# Altium schematic sheet ANALOG.SchDoc
size A3; DocumentNumber: 1; SheetNumber: 1; SheetTotal: 2
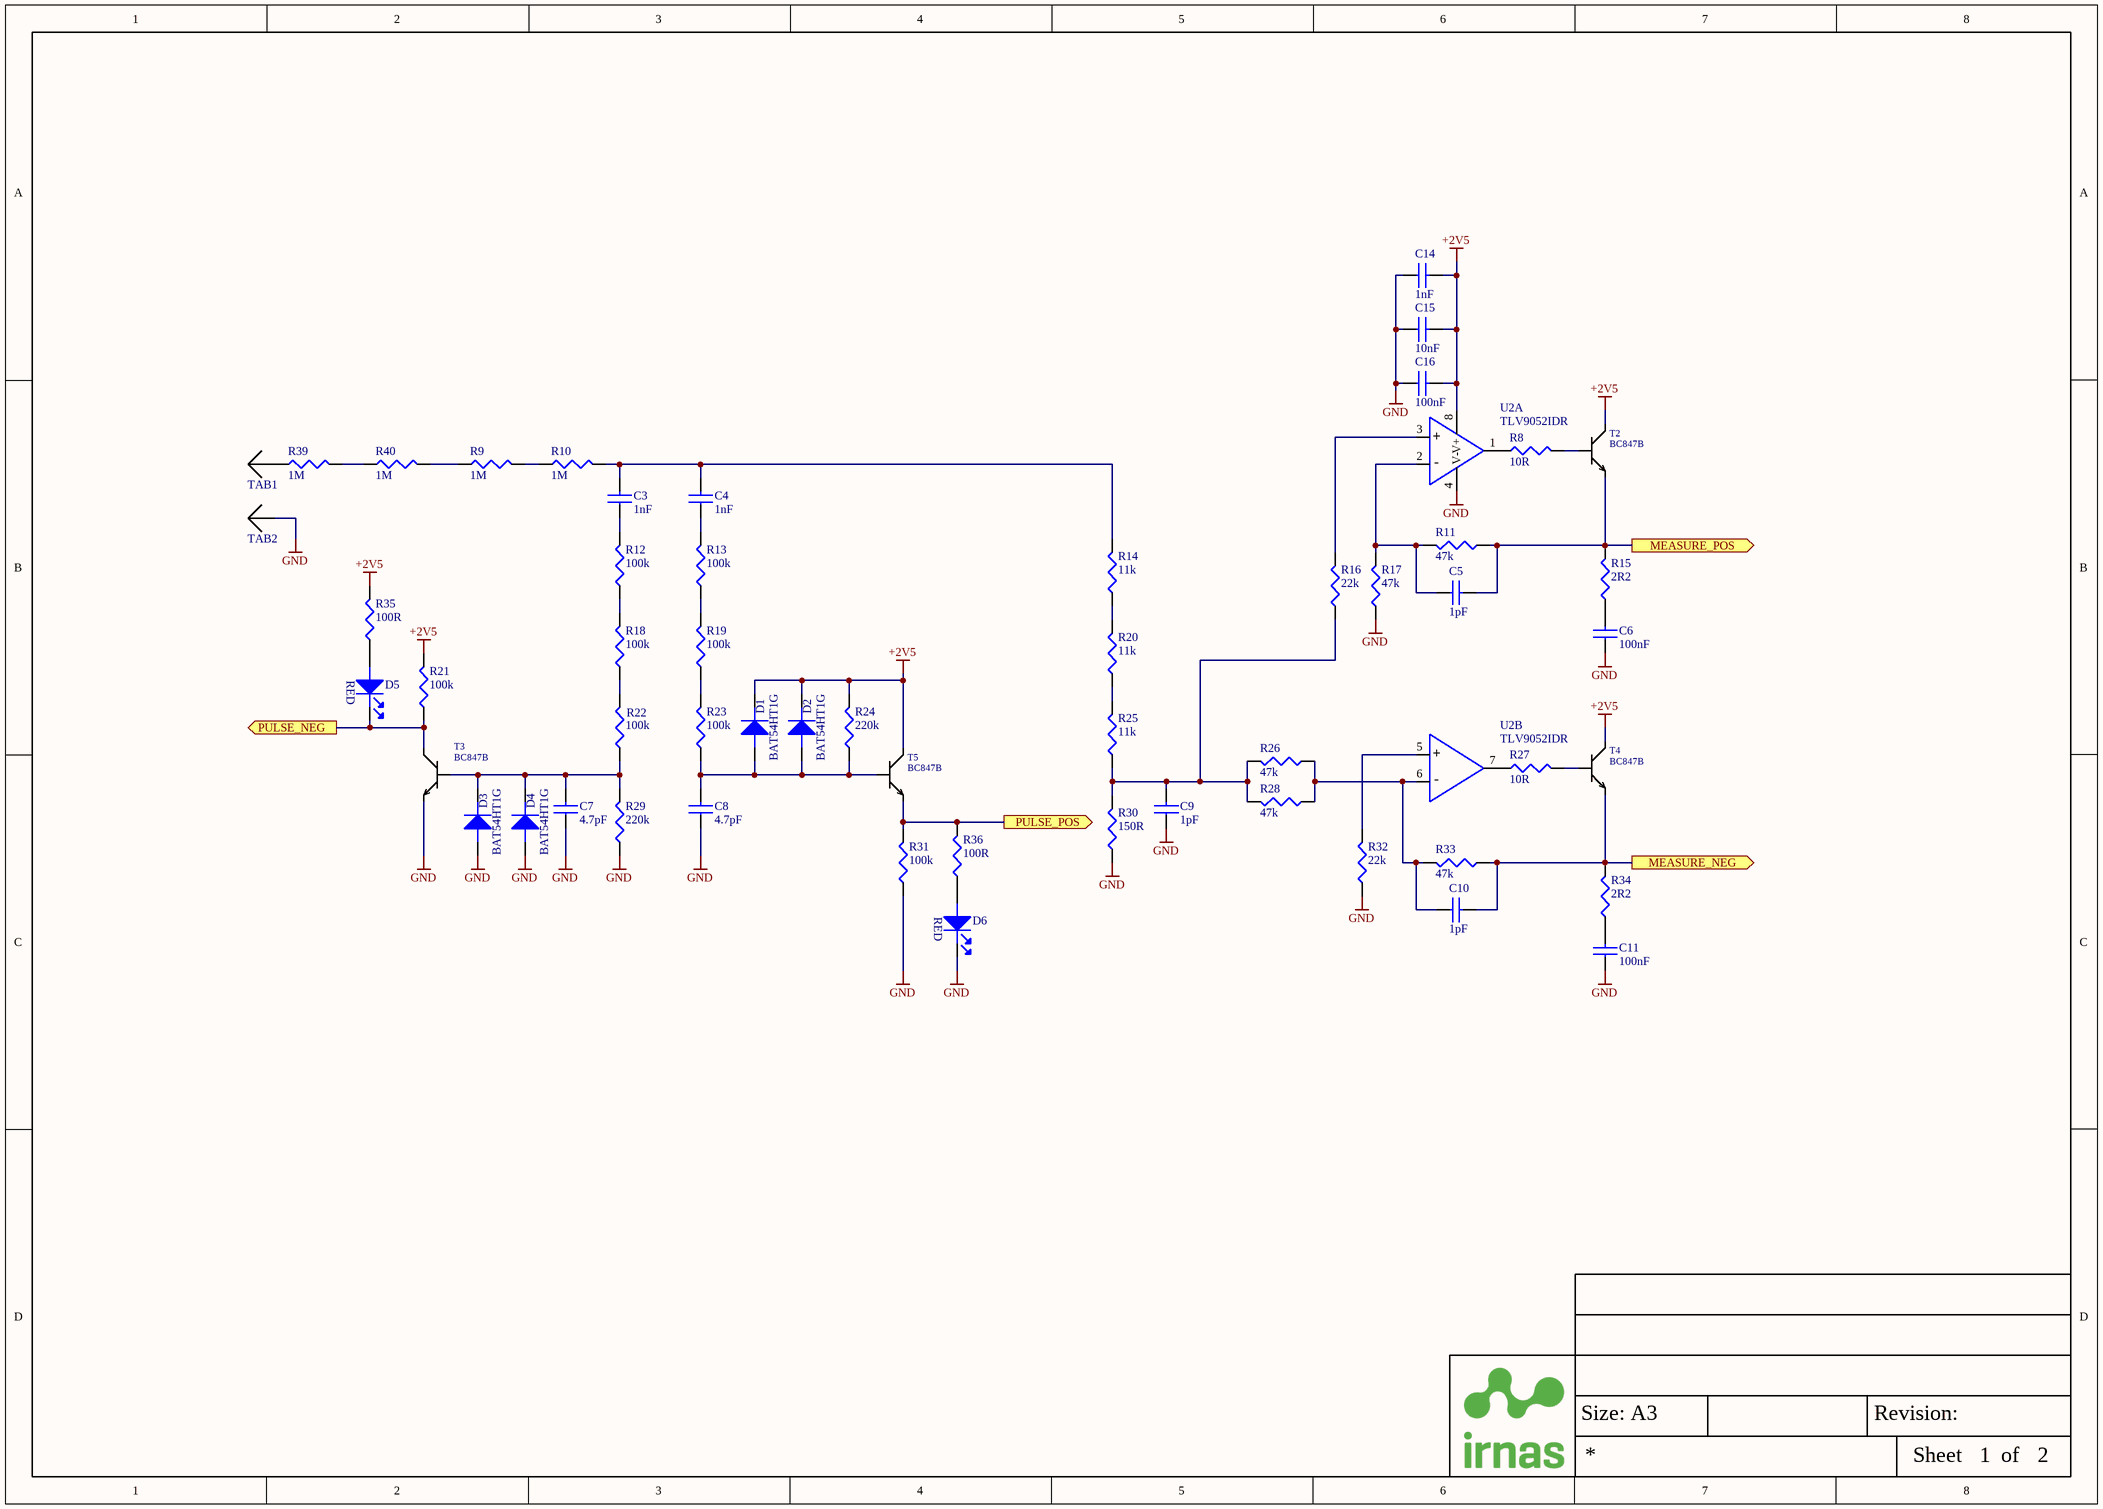
[diagram p0: ANALOG.SchDoc]

## Parts
C3  1nF  [CAP0805]
C4  1nF  [CAP0805]
C5  1pF  [CAP0402]
C6  100nF  [CAP0402]
C7  4.7pF  [CAP0603]
C8  4.7pF  [CAP0603]
C9  1pF  [CAP0402]
C10  1pF  [CAP0402]
C11  100nF  [CAP0402]
C14  1nF  [CAP0402]
C15  10nF  [CAP0402]
C16  100nF  [CAP0402]
D1  BAT54HT1G  [SOD-323 2L]
D2  BAT54HT1G  [SOD-323 2L]
D3  BAT54HT1G  [SOD-323 2L]
D4  BAT54HT1G  [SOD-323 2L]
D5  LED RED  [LED0603]  (value not drawn)
D6  LED RED  [LED0603]  (value not drawn)
R8  10R  [RES0402]
R9  1M  [RES2512]
R10  1M  [RES2512]
R11  47k  [RES0402]
R12  100k  [RES0603]
R13  100k  [RES0603]
R14  11k  [RES0603]
R15  2R2  [RES0402]
R16  22k  [RES0402]
R17  47k  [RES0402]
R18  100k  [RES0603]
R19  100k  [RES0603]
R20  11k  [RES0603]
R21  100k  [RES0402]
R22  100k  [RES0603]
R23  100k  [RES0603]
R24  220k  [RES0402]
R25  11k  [RES0603]
R26  47k  [RES0402]
R27  10R  [RES0402]
R28  47k  [RES0402]
R29  220k  [RES0603]
R30  150R  [RES0603]
R31  100k  [RES0402]
R32  22k  [RES0402]
R33  47k  [RES0402]
R34  2R2  [RES0402]
R35  100R  [RES0402]
R36  100R  [RES0402]
R39  1M  [RES2512]
R40  1M  [RES2512]
T2  BC847B  [SOT 23]
T3  BC847B  [SOT 23]
T4  BC847B  [SOT 23]
T5  BC847B  [SOT 23]
TAB1  WP-SMBU SMD  [WP-SMBU]  (value not drawn)
TAB2  WP-SMBU SMD  [WP-SMBU]  (value not drawn)
U2  TLV9052IDR  [SOIC-8 REFLOW]  (parts A,B of 2)

## Ports
MEASURE_NEG (out), MEASURE_POS (out), PULSE_NEG (out), PULSE_POS (out)

## Nets
+2V5: C14.2 C15.2 C16.2 D1.1(cathode) D2.1(cathode) R21.2 R24.2 R35.2 T2.3(C) T4.3(C) T5.3(C) U2.8(V+)
GND: C6.1 C7.1 C8.1 C9.1 C11.1 C14.1 C15.1 C16.1 D3.2(ANODE) D4.2(ANODE) D6.1(cathode) R17.1 R29.1 R30.1 R31.1 R32.1 T3.2(E) TAB2.1(ALERT) U2.4(V-)
MEASURE_NEG: C10.2 R33.1 R34.2 T4.2(E) ; port MEASURE_NEG
MEASURE_POS: C5.2 R11.1 R15.2 T2.2(E) ; port MEASURE_POS
PULSE_NEG: D5.1(cathode) R21.1 T3.3(C) ; port PULSE_NEG
PULSE_POS: R31.2 R36.2 T5.2(E) ; port PULSE_POS
NetC3_1: C3.1 R12.2
NetC3_2: C3.2 C4.2 R10.2 R14.2
NetC4_1: C4.1 R13.2
NetC5_1: C5.1 R11.2 R17.2 U2.2(-INA)
NetC6_2: C6.2 R15.1
NetC7_2: C7.2 D3.1(cathode) D4.1(cathode) R22.1 R29.2 T3.1(G)
NetC8_2: C8.2 D1.2(ANODE) D2.2(ANODE) R23.1 R24.1 T5.1(G)
NetC9_2: C9.2 R16.1 R25.1 R26.2 R28.2 R30.2
NetC10_1: C10.1 R26.1 R28.1 R33.2 U2.6(-INB)
NetC11_2: C11.2 R34.1
NetD5_2: D5.2(ANODE) R35.1
NetD6_2: D6.2(ANODE) R36.1
NetR8_1: R8.1 U2.1(OUTA)
NetR8_2: R8.2 T2.1(G)
NetR9_1: R9.1 R40.2
NetR9_2: R9.2 R10.1
NetR12_1: R12.1 R18.2
NetR13_1: R13.1 R19.2
NetR14_1: R14.1 R20.2
NetR16_2: R16.2 U2.3(+INA)
NetR18_1: R18.1 R22.2
NetR19_1: R19.1 R23.2
NetR20_1: R20.1 R25.2
NetR27_1: R27.1 U2.7(OUTB)
NetR27_2: R27.2 T4.1(G)
NetR32_2: R32.2 U2.5(+INB)
NetR39_1: R39.1 TAB1.1(ALERT)
NetR39_2: R39.2 R40.1

## Notes on the sheet
- Size: A3
- Revision:
- Sheet
- of
- (in symbol LED - LED RED) RED
- (in symbol OP - TLV9052IDR, part A) +; -
- (in symbol OP - TLV9052IDR, part B) +; -

## Library data of the parts
C3 C4 = C - 2.2uF/0805: Multilayer Ceramic Capacitors MLCC - SMD/SMT 2.2uF 25V X7R 10%; Manufacturer: Yageo; Manufacturer Part Number: CC0805KKX7R8BB225; IRNAS Part No.: /; Stock 1: 0; Pricing 1: 5=0.269, 50=0.163, 250=0.109, 500=0.0929, 1500=0.0722, 3000=0.0594, 15000=0.05 (GBP); Mount: Surface Mount; Case/Package: 0805; Number of Pins: 2; Case Code (Imperial): 0805; Case Code (Metric): 2012; Min Operating Temperature: -55°C; Max Operating Temperature: 125°C; Packaging: Tape and Reel; Voltage Rating: 25V; Voltage Rating (DC): 25V; Tolerance: 10%; Capacitance: 2.2uF; Dielectric: X7R; Termination: SMD/SMT; Composition: Ceramic; Length: 2mm; Height: 0.3mm; Depth: 1.25mm; Width: 1.25mm; Thickness: 0.057inch; Radiation Hardening: No; REACH SVHC: Unknown; Lead Free: Lead Free; Halogen Free: Halogen Free; ComponentLink1URL: https://datasheet.ciiva.com/7009/775840-7009706.pdf; ComponentLink1Description: https://datasheet.ciiva.com/7009/775840-7009706.pdf; Supplier 1: Farnell; Supplier Part Number 1: 2320784
C5 C9 C10 = C - 1pF/0402: Multilayer Ceramic Capacitors MLCC - SMD/SMT 50volts 1.8pF C0G; Manufacturer: KEMET; Manufacturer Part Number: C0402C189B5GACTU; IRNAS Part No.: /; Voltage Rating: 50V; Stock 1: 8950; Pricing 1: 10=0.463, 100=0.248, 500=0.182, 2500=0.153, 5000=0.134, 10000=0.11, 50000=0.0961 (EUR); Case/Package: 0402; Case Code (Imperial): 0402; Case Code (Metric): 1005; Dielectric Material: Ceramic; Min Operating Temperature: -55°C; Max Operating Temperature: 125°C; Packaging: Tape and Reel; Voltage Rating (DC): 50V; Capacitance: 1.8pF; Termination: SMD/SMT; Lead Free: Lead Free; ComponentLink1URL: https://datasheet.ciiva.com/5413/kem-c1003-c0g-smd-5413366.pdf; ComponentLink1Description: https://datasheet.ciiva.com/5413/kem-c1003-c0g-smd-5413366.pdf; Supplier 1: Farnell; Supplier Part Number 1: 2533789
C6 C11 C16 = C - 100nF/0402: MULTICOMP         MC0402X104J160CT             SMD Multilayer Ceramic Capacitor, 0402 [1005 Metric], 0.1 F, 16 V,  5%, X5R, MC Series                          New; IRNAS Part No.: /; Voltage Rating: 16V; Supplier 1: Farnell; Manufacturer: Multicomp; Manufacturer Part Number: MC0402X104J160CT; Stock 1: 3230; Pricing 1: 10=0.0139, 100=0.0108, 500=0.0076, 2500=0.0051, 5000=0.0038 (EUR); Case Code (Metric): 1005; Case Code (Imperial): 0402; Min Operating Temperature: -55°C; Max Operating Temperature: 85°C; Capacitance: 100nF; Dielectric: X5R; Packaging: Tape and Reel; Tolerance: 5%; Voltage Rating (DC): 16V; REACH SVHC: No SVHC; ComponentLink1URL: http://www.farnell.com/datasheets/2117933.pdf; ComponentLink1Description: http://www.farnell.com/datasheets/2117933.pdf; ComponentLink2URL: http://www.farnell.com/datasheets/2117900.pdf; ComponentLink2Description: http://www.farnell.com/datasheets/2117900.pdf; Supplier Part Number 1: 2627419
C7 C8 = C - 4u7  16V 0603: MURATA - GRM188R61C475KAAJD - CAP, MLCC, X5R, 4.7UF, 16V, 0603; IRNAS Part No.: I-200001; Ceramic Capacitor Case: 0603 [1608 Metric]; Capacitance: 4.7; Voltage Rating: 16; Capacitance Tolerance: ± 10%; Dielectric Characteristic: X5; Product Range: GRM Series; SVHC: No SVHC (17-Dec-2015)<!--FANDB--><div class="features-and-benefits-container"><div class="features-and-benefits-desc-container"><span class="features-and-benefits-container-desc">SMD Multilayer Ceramic Capacitor, 0603 [1608 Metric], 4.7 µF, 16 V, ± 10%, X5; Manufacturer: MURATA; Manufacturer Part Number: GRM188R61C475KAAJD; RoHS: YES; Stock 1: 5038; Pricing 1: 10=0.16, 100=0.0929, 500=0.076, 1000=0.0618, 2000=0.0605, 4000=0.0425, 20000=0.0409, 40000=0.0355 (GBP); Packaging: Cut Tape; Operating Temperature Min: -55; Operating Temperature Max: 85; Automotive Qualification Standard: -; MSL: MSL 1 - Unlimited; ComponentLink1URL: http://www.farnell.com/datasheets/2079168.pdf; ComponentLink1Description: http://www.farnell.com/datasheets/2079168.pdf; Supplier 1: Farnell; Supplier Part Number 1: 2812123
C14 = C - 1nF/0402: CAP CER 1000PF 50V X7R 0402; Manufacturer: Murata; Manufacturer Part Number: GCM155R71H102KA37D; IRNAS Part No.: /; Tolerance: 10%; Supplier 1: Farnell; Stock 1: 0; Mount: Surface Mount; Case/Package: 0402; Case Code (Metric): 1005; Case Code (Imperial): 0402; Min Operating Temperature: -55°C; Max Operating Temperature: 125°C; Capacitance: 1nF; Dielectric: X7R; Termination: SMD/SMT; Package Quantity: 1; Packaging: Tape and Reel; Voltage Rating (DC): 50V; Voltage Rating: 50V; Voltage: 50V; Length: 1mm; Height: 0.5mm; Width: 0.02inch; Thickness: 0.022inch; Depth: 0.5mm; Radiation Hardening: No; REACH SVHC: No SVHC; Lead Free: Lead Free; ComponentLink1URL: https://datasheet.ciiva.com/130/product-130720.pdf; ComponentLink1Description: https://datasheet.ciiva.com/130/product-130720.pdf; ComponentLink2URL: https://datasheet.ciiva.com/18183/getdatasheetpartid-140970-18183520.pdf; ComponentLink2Description: https://datasheet.ciiva.com/18183/getdatasheetpartid-140970-18183520.pdf; ComponentLink3URL: https://datasheet.ciiva.com/3778/3103gcm155r71h102ka3723-3778878.pdf; ComponentLink3Description: https://datasheet.ciiva.com/3778/3103gcm155r71h102ka3723-3778878.pdf; ComponentLink4URL: https://datasheet.ciiva.com/11786/0900766b80ef92d0-11786143.pdf; ComponentLink4Description: https://datasheet.ciiva.com/11786/0900766b80ef92d0-11786143.pdf; ComponentLink5URL: https://datasheet.ciiva.com/17453/product-17453655.pdf; ComponentLink5Description: https://datasheet.ciiva.com/17453/product-17453655.pdf; ComponentLink6URL: https://datasheet.ciiva.com/16213/product-16213384.pdf; ComponentLink6Description: https://datasheet.ciiva.com/16213/product-16213384.pdf; Supplier Part Number 1: 2470415
C15 = C - 10nF/0402: CAP CER 10000PF 16V X7R 0402; Manufacturer: Murata; Manufacturer Part Number: GRM155R71C103KA01D; IRNAS Part No.: /; Tolerance: 10%; Supplier 1: Farnell; Stock 1: 16478; Pricing 1: 10=0.0216, 100=0.0151, 500=0.0104, 2500=0.0069, 5000=0.0056 (EUR); Mount: Surface Mount; Case/Package: 0402; Number of Pins: 2; Case Code (Metric): 1005; Case Code (Imperial): 0402; Min Operating Temperature: -55°C; Max Operating Temperature: 125°C; Package Quantity: 1; Capacitance: 10nF; Voltage Rating: 16V; Packaging: Tape and Reel; Voltage Rating (DC): 16V; Dielectric: X7R; Termination: SMD/SMT; Voltage: 16V; Length: 1mm; Height: 0.5mm; Width: 0.02inch; Thickness: 0.022inch; Depth: 0.5mm; Radiation Hardening: No; REACH SVHC: No SVHC; Lead Free: Lead Free; ComponentLink1URL: https://datasheet.ciiva.com/129/partnumbering-e-01-129774.pdf; ComponentLink1Description: https://datasheet.ciiva.com/129/partnumbering-e-01-129774.pdf; ComponentLink2URL: https://datasheet.ciiva.com/129/partnumbering-e-01-129775.pdf; ComponentLink2Description: https://datasheet.ciiva.com/129/partnumbering-e-01-129775.pdf; ComponentLink3URL: https://datasheet.ciiva.com/129/product-129776.pdf; ComponentLink3Description: https://datasheet.ciiva.com/129/product-129776.pdf; ComponentLink4URL: https://datasheet.ciiva.com/18184/getdatasheetpartid-178863-18184649.pdf; ComponentLink4Description: https://datasheet.ciiva.com/18184/getdatasheetpartid-178863-18184649.pdf; ComponentLink5URL: https://datasheet.ciiva.com/22698/608985-22698415.pdf; ComponentLink5Description: https://datasheet.ciiva.com/22698/608985-22698415.pdf; ComponentLink6URL: https://datasheet.ciiva.com/7937/608985-7937614.pdf; ComponentLink6Description: https://datasheet.ciiva.com/7937/608985-7937614.pdf; Supplier Part Number 1: 1828864
D1-D4 = DS - BAT54HT1G: FAIRCHILD SEMICONDUCTOR - BAT54HT1G - DIODE, SCHOTTKY, 30V, SOD-323; Diode Configuration: Single; Repetitive Reverse Voltage Vrrm Max: 30; Forward Current If(AV): 200; Forward Voltage VF Max: 800; Forward Surge Current Ifsm Max: 600; No. of Pins: 2; Product Range: BAT54 Series; SVHC: No SVHC (15-Jun-2015); Reverse Recovery Time trr Max: 5ns<!--FANDB--><div class="features-and-benefits-container"><div class="features-and-benefits-description"><span class="features-benefits-value">The BAT54HT1G is a Schottky Barrier Diode for general usage and suitable for many different applications.</span></div><div class="features-and-benefits-list"><ul class="features-and-benefits-list-list"><li class="features-and-benefits-list-item">-65 to 150°C Storage temperature range</li><li class="features-and-benefits-list-item">-55 to 150; Supplier 1: Farnell; Manufacturer: FAIRCHILD SEMICONDUCTOR; Manufacturer Part Number: BAT54HT1G; RoHS: YES; Stock 1: 5495; Pricing 1: 1=0.0747, 250=0.065, 500=0.055, 1000=0.045, 3000=0.0349, 9000=0.0279 (GBP); Operating Temperature Max: 150; Diode Case Style: SOD-323; Packaging: Cut Tape; Automotive Qualification Standard: -; MSL: MSL 1 - Unlimited; ComponentLink1URL: http://www.farnell.com/datasheets/2251626.pdf; ComponentLink1Description: http://www.farnell.com/datasheets/2251626.pdf; Supplier Part Number 1: 2453769
D5 D6 = LED - LED RED: BROADCOM LIMITED - HSMS-C190 - LED, RED, 10MCD, 626NM; LED Mounting: SMD; Forward Current If: 20; Forward Voltage: 2.1; Wavelength Typ: 626; Luminous Intensity: 10; Viewing Angle: 170°; Lens Shape: Rectangular; SVHC: No SVHC (17-Dec-2015)<!--FANDB--><div class="features-and-benefits-container"><div class="features-and-benefits-description"><span class="features-benefits-value">The HSMS-C190 is a HER SMD Chip LED with untinted/diffused lens, made of GaP. It is designed in an industry standard package 1.6 x 0.8mm footprint with 0.8mm profile. It is compatible with IR reflow solder processes. The small size and wide viewing angle make this LED prime choices for backlighting applications and front panel illumination especially where space is a premium.</span></div><div class="features-and-benefits-list"><ul class="features-and-benefits-list-list"><li class="features-and-benefits-list-item">Small size</li><li class="features-and-benefits-list-item">Industry standard footprint</li><li class="features-and-benefits-list-item">Compatible with IR solder</li><li class="features-and-benefits-list-item">Diffused optics</li><li class="features-and-benefits-list-item">-40 to 85; Supplier 1: Farnell; Manufacturer: BROADCOM LIMITED; Manufacturer Part Number: HSMS-C190; RoHS: YES; Stock 1: 7534; Pricing 1: 1=0.361, 10=0.256, 50=0.235, 100=0.106, 200=0.101 (GBP); LED Colour: Red; Bulb Size: -; Packaging: Cut Tape; Product Range: -; Automotive Qualification Standard: -; MSL: -; ComponentLink1URL: http://www.farnell.com/datasheets/313031.pdf; ComponentLink1Description: http://www.farnell.com/datasheets/313031.pdf; ComponentLink2URL: http://www.farnell.com/datasheets/1681524.pdf; ComponentLink2Description: http://www.farnell.com/datasheets/1681524.pdf; ComponentLink3URL: http://www.farnell.com/datasheets/2165483.pdf; ComponentLink3Description: http://www.farnell.com/datasheets/2165483.pdf; Supplier Part Number 1: 2497356
R8 R27 = R - 10R/0402: SMD Chip Resistor, 0402 [1005 Metric], 10 ohm, CRCW e3 Series, 50 V, Thick Film, 63 mW; Manufacturer: VISHAY; Manufacturer Part Number: RCA060310R0FKEA; IRNAS Part No.: I-100010; Resistance: 10; Voltage Rating: 75; Resistor Case Style: 0603 [1608 Metric]; Power Rating: 100; Resistance Tolerance: ± 1%; Product Range: RCA Series; Temperature Coefficient: ± 100; Automotive Qualification Standard: AEC-Q200; SVHC: No SVHC (17-Dec-2015)<!--FANDB--><div class="features-and-benefits-container"><div class="features-and-benefits-description"><span class="features-benefits-value">The RCA series from Vishay are automotive grade, sulphur resistant thick film rectangular chip resistors. The resistance range includes E24 and E96 decade values from 1ohm to 10Mohm. They provide superior resistance against H2S atmosphere. These resistors have metal glaze on high quality ceramic.</span></div><div class="features-and-benefits-list"><ul class="features-and-benefits-list-list"><li class="features-and-benefits-list-item">Automotive grade AEC-Q200 qualified (rev C)</li><li class="features-and-benefits-list-item">EIA 0402, 0603, 0805, 1206, 1210, 1218, 2010 and 2512 case sizes available</li><li class="features-and-benefits-list-item">Available in ±0.5%, ±1% and ±5% tolerances</li><li class="features-and-benefits-list-item">Jumpers are also available</li><li class="features-and-benefits-list-item">±50ppm/K, ±100ppm/K and ±200ppm/K TCR values</li><li class="features-and-benefits-list-item">Power rating of 0.063W, 0.10W, 0.125W, 0.25W, 0.5W, 0.75W and 1W at 70?C</li><li class="features-and-benefits-list-item">Available in 50V, 75V, 150V, 200V, 400V and 500V limiting voltage options</li><li class="features-and-benefits-list-item">Category temperature range from -55?C to 155?C</li><li class="features-and-benefits-list-item">Stability ?R/R = 1 % for 1000h at 70; RoHS: YES; Stock 1: 9559; Pricing 1: 10=0.0803, 100=0.0386, 500=0.0235, 2500=0.015, 5000=0.0135, 10000=0.0108, 50000=0.0068, 100000=0.0067 (GBP); Packaging: Cut Tape; Resistor Element Material: Thick Film; ComponentLink1URL: http://www.farnell.com/datasheets/2111201.pdf; ComponentLink1Description: http://www.farnell.com/datasheets/2111201.pdf; Supplier 1: Farnell; Supplier Part Number 1: 1652742
R9 R10 R39 R40 = R - 1M/2512: SMD Chip Resistor, 2512 [6432 Metric], 1 Mohm, CRCW e3 Series, 500 V; Manufacturer: MULTICOMP; Manufacturer Part Number: MC0063W060311M; IRNAS Part No.: I-100006; Resistance: 1; Voltage Rating: 50; Resistor Case Style: 0603 [1608 Metric]; Power Rating: 63; Resistance Tolerance: ± 1%; Product Range: MC Series; Resistor Element Material: Thick Film; Temperature Coefficient: ± 100; SVHC: No SVHC (17-Dec-2015); External Depth: 0.45; External Length / Height: 1.6; External Width: 0.8; No. of Pins: 2; Reel Quantity: 5000; Resistor Mounting: Surface Mount Device; Temperature Coeff. +: 100; Tolerance +: 1%; Voltage Rating V DC: 50V<!--FANDB--><div class="features-and-benefits-container"><div class="features-and-benefits-description"><span class="features-benefits-value">The Multicomp MC series current sense resistors are thick film chip resistors. The resistance range includes E96 and E24 decade values from 1ohm to 10Mohm.</span></div><div class="features-and-benefits-list"><ul class="features-and-benefits-list-list"><li class="features-and-benefits-list-item">EIA 0402, 0603, 0805, 1206 chip sizes available</li><li class="features-and-benefits-list-item">Small size and low weight</li><li class="features-and-benefits-list-item">Suitable for both wave and reflow soldering</li><li class="features-and-benefits-list-item">Reduction of assembly costs</li><li class="features-and-benefits-list-item">Maximum working voltage of 50V(0402, 0603), 150V(0805), 200V(1206)</li><li class="features-and-benefits-list-item">Available in ±1%, ±2% and ±5% tolerance</li><li class="features-and-benefits-list-item">Power rating of 62.5mW, 100mW and 125mW</li><li class="features-and-benefits-list-item">±400ppm/°C(1ohm to 10ohm), ±200ppm/°C(11ohm to 100ohm), ±100; RoHS: Y-EX; Stock 1: 333415; Pricing 1: 10=0.0011, 100=0.001, 500=0.0009, 1000=0.0008, 2500=0.0007 (GBP); Packaging: Cut Tape; Automotive Qualification Standard: -; Operating Temperature Max: 155; Operating Temperature Min: -55; Operating Temperature Range: -55°C to +155; Tape Width: 8; Temperature Coeff. -: 100; Tolerance -: 1%; ComponentLink1URL: http://www.farnell.com/datasheets/1788326.pdf; ComponentLink1Description: http://www.farnell.com/datasheets/1788326.pdf; ComponentLink2URL: http://www.farnell.com/cad/1558928.zip; ComponentLink2Description: http://www.farnell.com/cad/1558928.zip; Supplier 1: Farnell; Supplier Part Number 1: 2395991
R11 R17 R26 R28 R33 = R - 47k/0402: MULTICOMP - MCMR06X4702FTL - RES, CERAMIC, 47K, 1%, 0.1W, 0603; IRNAS Part No.: I-100002; Resistance: 47; Voltage Rating: 75; Resistor Case Style: 0603 [1608 Metric]; Power Rating: 100; Product Range: MCMR Series; Temperature Coefficient: ± 100; Automotive Qualification Standard: -<!--FANDB--><div class="features-and-benefits-container"><div class="features-and-benefits-description"><span class="features-benefits-value">The Multicomp MCMR series resistors are automotive grade, anti sulphured thick film chip resistor. The resistance range includes E24 and E96 decade values from 1ohm to 10Mohm. These resistors are constructed on top of a high grade ceramic body.</span></div><div class="features-and-benefits-list"><ul class="features-and-benefits-list-list"><li class="features-and-benefits-list-item">EIA 0402, 0603, 0805, 1206 chip sizes available</li><li class="features-and-benefits-list-item">High reliability and stability</li><li class="features-and-benefits-list-item">Automotive grade AEC-Q200 compliant</li><li class="features-and-benefits-list-item">Complaint with (IEC 60068-1) 55/155/56 climatic category</li><li class="features-and-benefits-list-item">Maximum operation voltage of 50V, 75V, 150V and 200V</li><li class="features-and-benefits-list-item">Power rating of 62.5mW, 100mW, 125mW and 250mW</li><li class="features-and-benefits-list-item">Available in ±1% and ±5% tolerance</li><li class="features-and-benefits-list-item">Temperature coefficient (TCR) of +200ppm/°C, +100ppm/°C and -200ppm/°C to +400ppm/°C</li><li class="features-and-benefits-list-item">Operating temperature range -55°C to 155; Manufacturer: MULTICOMP; Manufacturer Part Number: MCMR06X4702FTL; RoHS: Y-EX; Stock 1: 21427; Pricing 1: 10=0.0115, 100=0.009, 500=0.0064, 1000=0.0051, 2500=0.0042, 5000=0.0032, 25000=0.0021, 50000=0.0017 (GBP); Resistance Tolerance: ± 1%; Packaging: Cut Tape; Resistor Element Material: Ceramic; ComponentLink1URL: http://www.farnell.com/datasheets/1716707.pdf; ComponentLink1Description: http://www.farnell.com/datasheets/1716707.pdf; Supplier 1: Farnell; Supplier Part Number 1: 1469719
R12 R13 R18 R19 R22 R23 = R - 100k: MULTICOMP - MCMR06X104 JTL - RES, CERAMIC, 100K, 5%, 0.1W, 0603; IRNAS Part No.: I-100007; Resistance: 100; Voltage Rating: 75; Resistor Case Style: 0603 [1608 Metric]; Product Range: MCMR Series; Temperature Coefficient: ± 100; Resistor Mounting: Surface Mount Device<!--FANDB--><div class="features-and-benefits-container"><div class="features-and-benefits-description"><span class="features-benefits-value">The Multicomp MCMR series resistors are automotive grade, anti sulphured thick film chip resistor. The resistance range includes E24 and E96 decade values from 1ohm to 10Mohm. These resistors are constructed on top of a high grade ceramic body.</span></div><div class="features-and-benefits-list"><ul class="features-and-benefits-list-list"><li class="features-and-benefits-list-item">EIA 0402, 0603, 0805, 1206 chip sizes available</li><li class="features-and-benefits-list-item">High reliability and stability</li><li class="features-and-benefits-list-item">Automotive grade AEC-Q200 compliant</li><li class="features-and-benefits-list-item">Complaint with (IEC 60068-1) 55/155/56 climatic category</li><li class="features-and-benefits-list-item">Maximum operation voltage of 50V, 75V, 150V and 200V</li><li class="features-and-benefits-list-item">Power rating of 62.5mW, 100mW, 125mW and 250mW</li><li class="features-and-benefits-list-item">Available in ±1% and ±5% tolerance</li><li class="features-and-benefits-list-item">Temperature coefficient (TCR) of +200ppm/°C, +100ppm/°C and -200ppm/°C to +400ppm/°C</li><li class="features-and-benefits-list-item">Operating temperature range -55°C to 155; Supplier 1: Farnell; Manufacturer: MULTICOMP; Manufacturer Part Number: MCMR06X104 JTL; RoHS: Y-EX; Stock 1: 187; Pricing 1: 10=0.0109, 100=0.0085, 500=0.006, 1000=0.0048, 2500=0.004, 5000=0.003, 25000=0.002, 50000=0.0016 (GBP); Power Rating: 100; Resistance Tolerance: ± 5%; Packaging: Cut Tape; Resistor Element Material: Ceramic; Automotive Qualification Standard: -; ComponentLink1URL: http://www.farnell.com/datasheets/1716707.pdf; ComponentLink1Description: http://www.farnell.com/datasheets/1716707.pdf; Supplier Part Number 1: 2073357
R14 R20 R25 = R - 10k: MULTICOMP - MCMR06X103 JTL - RES, CERAMIC, 10K, 5%, 0.1W, 0603; IRNAS Part No.: I-100008; Resistance: 10; Voltage Rating: 75; Resistor Case Style: 0603 [1608 Metric]; Power Rating: 100; Product Range: MCMR Series; Temperature Coefficient: ± 100; Automotive Qualification Standard: -<!--FANDB--><div class="features-and-benefits-container"><div class="features-and-benefits-description"><span class="features-benefits-value">The Multicomp MCMR series resistors are automotive grade, anti sulphured thick film chip resistor. The resistance range includes E24 and E96 decade values from 1ohm to 10Mohm. These resistors are constructed on top of a high grade ceramic body.</span></div><div class="features-and-benefits-list"><ul class="features-and-benefits-list-list"><li class="features-and-benefits-list-item">EIA 0402, 0603, 0805, 1206 chip sizes available</li><li class="features-and-benefits-list-item">High reliability and stability</li><li class="features-and-benefits-list-item">Automotive grade AEC-Q200 compliant</li><li class="features-and-benefits-list-item">Complaint with (IEC 60068-1) 55/155/56 climatic category</li><li class="features-and-benefits-list-item">Maximum operation voltage of 50V, 75V, 150V and 200V</li><li class="features-and-benefits-list-item">Power rating of 62.5mW, 100mW, 125mW and 250mW</li><li class="features-and-benefits-list-item">Available in ±1% and ±5% tolerance</li><li class="features-and-benefits-list-item">Temperature coefficient (TCR) of +200ppm/°C, +100ppm/°C and -200ppm/°C to +400ppm/°C</li><li class="features-and-benefits-list-item">Operating temperature range -55°C to 155; Manufacturer: MULTICOMP; Manufacturer Part Number: MCMR06X103 JTL; RoHS: Y-EX; Stock 1: 19791; Pricing 1: 10=0.0087, 100=0.0074, 500=0.0061, 1000=0.0048, 2500=0.0032, 5000=0.0024, 25000=0.0016, 50000=0.0013 (GBP); Resistance Tolerance: ± 5%; Packaging: Cut Tape; Resistor Element Material: Ceramic; ComponentLink1URL: http://www.farnell.com/datasheets/1716707.pdf; ComponentLink1Description: http://www.farnell.com/datasheets/1716707.pdf; Supplier 1: Farnell; Supplier Part Number 1: 2138424
R15 R34 = R - 2R2/0402: MULTICOMP         MCWR04X2001FTL            Surface Mount Chip Resistor, Thick Film, MCWR Series, 2 kohm, 62.5 mW,  1%, 50 V; IRNAS Part No.: /; Resistance: 2kR; Power Rating: 62.5mW; Voltage Rating: 50V; Temperature Coefficient: 100ppm/°C; Manufacturer: Multicomp; Manufacturer Part Number: MCWR04X2001FTL; Stock 1: 18534; Pricing 1: 10=0.0029, 100=0.0017, 500=0.0012, 2500=0.001, 5000=0.0008 (EUR); Mount: Surface Mount; Case/Package: 0402; Case Code (Metric): 1005; Case Code (Imperial): 0402; Tolerance: 1%; Packaging: Cut Tape; Composition: Thick Film; Voltage Rating (DC): 50V; REACH SVHC: No SVHC; ComponentLink1URL: https://datasheet.ciiva.com/46443/1849611-46443359.pdf; ComponentLink1Description: https://datasheet.ciiva.com/46443/1849611-46443359.pdf; Supplier 1: Farnell; Supplier Part Number 1: 2072887
R16 R32 = R - 22k/0402: SMD Chip Resistor, 0402 [1005 Metric], 22 kohm, MCWR Series, 50 V; Manufacturer: Panasonic; Manufacturer Part Number: ERJ-3EKF2202V; IRNAS Part No.: /; Resistance: 22kR; Power Rating: 100mW; Tolerance: 1%; Voltage Rating: 75V; Temperature Coefficient: 100ppm/°C; Stock 1: 1414926; Pricing 1: 1 = 0.10000, 10 = 0.06500, 100 = 0.02640, 1000 = 0.01186, 2500 = 0.01029 (USD); RoHS: Yes; Mount: Surface Mount; Case/Package: 0603; Number of Pins: 2; Case Code (Imperial): 0603; Case Code (Metric): 1608; Contact Plating: Tin; Min Operating Temperature: -55°C; Max Operating Temperature: 155°C; Packaging: Tape and Reel; Composition: Thick Film; Voltage Rating (DC): 75V; Termination: SMD/SMT; Package Quantity: 1; Number of Terminations: 2; Max Power Dissipation: 100mW; Military Standard: Not; Features: Automotive AEC-Q200; Length: 1.6mm; Height: 0.022inch; Width: 0.8mm; Depth: 0.8mm; Radiation Hardening: No; Lead Free: Lead Free; REACH SVHC: No SVHC; ComponentLink1URL: https://datasheet.ciiva.com/16770/70260748-16770054.pdf?src-supplier=Allied+Electronics; ComponentLink1Description: https://datasheet.ciiva.com/16770/70260748-16770054.pdf?src-supplier=Allied+Electronics; ComponentLink2URL: https://datasheet.ciiva.com/16788/70260748-16788918.pdf?src-supplier=Allied+Electronics; ComponentLink2Description: https://datasheet.ciiva.com/16788/70260748-16788918.pdf?src-supplier=Allied+Electronics; ComponentLink3URL: https://datasheet.ciiva.com/48531/aoa0000ce2-48531046.pdf?src-supplier=Avnet; ComponentLink3Description: https://datasheet.ciiva.com/48531/aoa0000ce2-48531046.pdf?src-supplier=Avnet; ComponentLink4URL: https://datasheet.ciiva.com/17210/aoa0000ce2-17210952.pdf?src-supplier=Avnet+Europe; ComponentLink4Description: https://datasheet.ciiva.com/17210/aoa0000ce2-17210952.pdf?src-supplier=Avnet+Europe; ComponentLink5URL: https://datasheet.ciiva.com/9116/aoa0000ce2-9116843.pdf?src-supplier=Avnet; ComponentLink5Description: https://datasheet.ciiva.com/9116/aoa0000ce2-9116843.pdf?src-supplier=Avnet; ComponentLink6URL: https://datasheet.ciiva.com/30063/aoa0000ce2-30063691.pdf?src-supplier=Onlinecomponents.com; ComponentLink6Description: https://datasheet.ciiva.com/30063/aoa0000ce2-30063691.pdf?src-supplier=Onlinecomponents.com; ComponentLink7URL: https://datasheet.ciiva.com/15158/getdatasheetpartid-246478-15158839.pdf?src-supplier=Verical; ComponentLink7Description: https://datasheet.ciiva.com/15158/getdatasheetpartid-246478-15158839.pdf?src-supplier=Verical; ComponentLink8URL: https://datasheet.ciiva.com/7802/1678782-7802681.pdf?src-supplier=Element14; ComponentLink8Description: https://datasheet.ciiva.com/7802/1678782-7802681.pdf?src-supplier=Element14; ComponentLink9URL: https://datasheet.ciiva.com/16511/aoa0000ce2-16511658.pdf?src-supplier=Avnet+Asia; ComponentLink9Description: https://datasheet.ciiva.com/16511/aoa0000ce2-16511658.pdf?src-supplier=Avnet+Asia; Supplier 1: Farnell; Supplier Part Number 1: 2447137
R21 R31 = R - 100k/0402: MULTICOMP   MCWR04X1003FTL   RES, THICK FILM, 100KOHM, 1%, 0.0625W; IRNAS Part No.: I-100013; Resistance: 100kR; Power Rating: 62.5mW; Voltage Rating: 50V; Temperature Coefficient: 100ppm/°C; Supplier 1: Farnell; Manufacturer: Multicomp; Manufacturer Part Number: MCWR04X1003FTL; Stock 1: 161188; Pricing 1: 10=0.0029, 100=0.0017, 500=0.0012, 2500=0.001, 5000=0.0008 (EUR); Mount: Surface Mount; Case/Package: 0402; Case Code (Metric): 1005; Case Code (Imperial): 0402; Tolerance: 1%; Packaging: Cut Tape; Composition: Thick Film; Voltage Rating (DC): 50V; REACH SVHC: No SVHC; ComponentLink1URL: https://datasheet.ciiva.com/46386/1849611-46386524.pdf; ComponentLink1Description: https://datasheet.ciiva.com/46386/1849611-46386524.pdf; Supplier Part Number 1: 2447094
R24 = R - 220k/0402: MULTICOMP  SMD Chip Resistor, 0603 [1608 Metric], 220 kohm, MCWR Series, 50 V, Thick Film, 100 mW; Manufacturer Part Number: MCWR06X2200FTL; IRNAS Part No.: I-100023; Resistance: 220; Voltage Rating: 50; Power Rating: 100; Resistance Tolerance: ± 1%; Temperature Coefficient: ± 100; SVHC: No SVHC (07-Jul-2017)<!--FANDB--><div class="features-and-benefits-container"><div class="features-and-benefits-desc-container"><span class="features-and-benefits-container-desc">SMD Chip Resistor, Thick Film, 220 ohm, 50 V, 0603 [1608 Metric], 100 mW, ± 1; Manufacturer: MULTICOMP; RoHS: Y-EX; Stock 1: 124834; Pricing 1: 10=0.0031, 100=0.0018, 500=0.0013, 1000=0.001, 2500=0.0008 (GBP); Resistor Case Style: 0603 [1608 Metric]; Product Range: MCWR Series; Packaging: Cut Tape; Resistor Element Material: Thick Film; Automotive Qualification Standard: -; ComponentLink1URL: http://www.farnell.com/datasheets/1849611.pdf; ComponentLink1Description: http://www.farnell.com/datasheets/1849611.pdf; Supplier 1: Farnell; Supplier Part Number 1: 2447135
R29 = R - 220k: MULTICOMP  SMD Chip Resistor, 0603 [1608 Metric], 220 kohm, MCWR Series, 50 V, Thick Film, 100 mW; Manufacturer Part Number: MCWR06X2200FTL; IRNAS Part No.: I-100023; Resistance: 220; Voltage Rating: 50; Power Rating: 100; Resistance Tolerance: ± 1%; Temperature Coefficient: ± 100; SVHC: No SVHC (07-Jul-2017)<!--FANDB--><div class="features-and-benefits-container"><div class="features-and-benefits-desc-container"><span class="features-and-benefits-container-desc">SMD Chip Resistor, Thick Film, 220 ohm, 50 V, 0603 [1608 Metric], 100 mW, ± 1; Supplier 1: Farnell; Manufacturer: MULTICOMP; RoHS: Y-EX; Stock 1: 124834; Pricing 1: 10=0.0031, 100=0.0018, 500=0.0013, 1000=0.001, 2500=0.0008 (GBP); Resistor Case Style: 0603 [1608 Metric]; Product Range: MCWR Series; Packaging: Cut Tape; Resistor Element Material: Thick Film; Automotive Qualification Standard: -; ComponentLink1URL: http://www.farnell.com/datasheets/1849611.pdf; ComponentLink1Description: http://www.farnell.com/datasheets/1849611.pdf; Supplier Part Number 1: 2447298
R30 = R - 150R: SMD Chip Resistor, 0603 [1608 Metric], 150 ohm, MCWR Series, 50 V, Thick Film, 100 mW; Manufacturer: MULTICOMP; Manufacturer Part Number: MCWR06X1503FTL; Resistance: 150; Voltage Rating: 50; Power Rating: 100; Resistance Tolerance: ± 1%; Temperature Coefficient: ± 100; SVHC: No SVHC (07-Jul-2017)<!--FANDB--><div class="features-and-benefits-container"><div class="features-and-benefits-desc-container"><span class="features-and-benefits-container-desc">SMD Chip Resistor, Thick Film, 150 kohm, 50 V, 0603 [1608 Metric], 100 mW, ± 1; RoHS: Y-EX; Stock 1: 11455; Pricing 1: 10=0.0033, 100=0.002, 500=0.0014, 1000=0.0011, 2500=0.0009 (GBP); Resistor Case Style: 0603 [1608 Metric]; Product Range: MCWR Series; Packaging: Cut Tape; Resistor Element Material: Thick Film; Automotive Qualification Standard: -; ComponentLink1URL: http://www.farnell.com/datasheets/2563624.pdf?_ga=2.225398170.1482069815.1565249558-1373726713.1554121096&_gac=1.53691866.1562763802.CjwKCAjwmZbpBRAGEiwADrmVXm8xT8OHDZvJe8qZIQyyGmIuiUD-TEITatw0hIdDkyBwIXXCH7oneRoCl7cQAvD_BwE; ComponentLink1Description: Datasheet; Supplier 1: Farnell; Supplier Part Number 1: 2447255
R35 R36 = R - 100R/0402: MULTICOMP         MCMR04X1000FTL            SMD Chip Resistor, Ceramic, MCMR Series, 100 ohm, 50 V, 0402 [1005 Metric], 62.5 mW,  1%; IRNAS Part No.: /; Temperature Coefficient: 100ppm/°C; Power Rating: 62.5mW; Voltage Rating: 50V; Supplier 1: Farnell; Manufacturer: Multicomp; Manufacturer Part Number: MCMR04X1000FTL; Stock 1: 62365; Pricing 1: 10=0.0071, 100=0.0042, 500=0.003, 2500=0.0024, 5000=0.0019 (GBP); Case/Package: 0402; Case Code (Metric): 1005; Case Code (Imperial): 0402; Resistance: 100R; Tolerance: 1%; Composition: Ceramic; Packaging: Cut Tape; Voltage Rating (DC): 50V; REACH SVHC: No SVHC; ComponentLink1URL: https://datasheet.ciiva.com/28692/1716705-28692087.pdf; ComponentLink1Description: https://datasheet.ciiva.com/28692/1716705-28692087.pdf; ComponentLink2URL: https://datasheet.ciiva.com/22708/1716705-22708156.pdf; ComponentLink2Description: https://datasheet.ciiva.com/22708/1716705-22708156.pdf; Supplier Part Number 1: 2072515
T2-T5 = T_B - BC847B,215: MOSFET Transistor, N Channel, 310 mA, 60 V, 0.86 ohm, 10 V, 1 V; Manufacturer: ON SEMICONDUCTOR; Komp / Device: SMD; Value: BSS123; Velikost / Size: SOT23; FIT: 0.44; Manufacturer Part Number: BC847B,215; Author: Ciril Golob; ComponentLink1Description: Datasheet; ComponentLink1URL: C:\ELRADSVN\Altium_Library\Libraries\Active\Datasheet\2N7002ET1G.pdf; Date: 11.07.2018; ComponentLINK1Description: Datasheet; ComponentLINK2Description: Datasheet www; ComponentLINK1URL: c:\ELRADSVN\Altium_Library\Libraries\Active\Datasheet\BSS123.pdf; ComponentLINK2URL: http://www.onsemi.com/pub/Collateral/BSS123-D.PDF; Supplier 1: Farnell; Supplier 2: Mouser; Supplier Part Number 1: 2317616; Supplier Part Number 2: 863-2N7002ET1G
TAB1 TAB2 = TAB - WP-SMBU SMD: WP-SMBU SMD Internal blind-hole thread w. Pins; ComponentLink1Description: Datasheet; ComponentLink1URL: https://katalog.we-online.com/em/datasheet/7466103.pdf; Supplier 1: Farnell; Supplier Part Number 1: 2405986
U2 = OP - TLV9052IDR: General Purpose Amplifier 2 Circuit Rail-to-Rail 8-SOIC; Manufacturer: Texas Instruments; Bandwidth: 90kHz; Max Supply Voltage: 5.5V; Min Supply Voltage: 1.8V; Voltage Gain: 120dB; Nominal Supply Current: 5.5uA; Common Mode Rejection Ratio: 90dB; Number of Channels: 1; Slew Rate: 0.03V/µs; Max I/O Voltage: 1.5mV; Input Bias Current: 50pA; Operating Supply Current: 2.9uA; Output Current per Channel: 5mA; Power Supply Rejection Ratio (PSRR): 113.98dB; Manufacturer Part Number: TLV9052IDR; Stock 1: 215; Pricing 1: 1=1.09, 25=0.954, 50=0.841, 100=0.728, 250=0.686, 500=0.644, 1000=0.509, 2500=0.502 (EUR); Case/Package: SOT-23; Number of Pins: 5; Min Operating Temperature: -40°C; Max Operating Temperature: 125°C; Packaging: Tape and Reel; Unity Gain Bandwidth Product: 90kHz; Package Quantity: 250; Nominal Gain Bandwidth Product: 90kHz; Input Offset Voltage (Vos): 1.5mV; Gain Bandwidth Product: 90kHz; Number of Circuits: 1; Number of Amplifiers: 1; Number of Elements: 1; Length: 2.9mm; Height: 1.15mm; Width: 1.6mm; Radiation Hardening: No; REACH SVHC: No SVHC; Lead Free: Lead Free; ComponentLink1URL: http://ww1.microchip.com/downloads/en/DeviceDoc/21669D.pdf; ComponentLink1Description: Datasheet; Supplier 1: Digi-Key; Supplier Part Number 1: 296-53049-1-ND